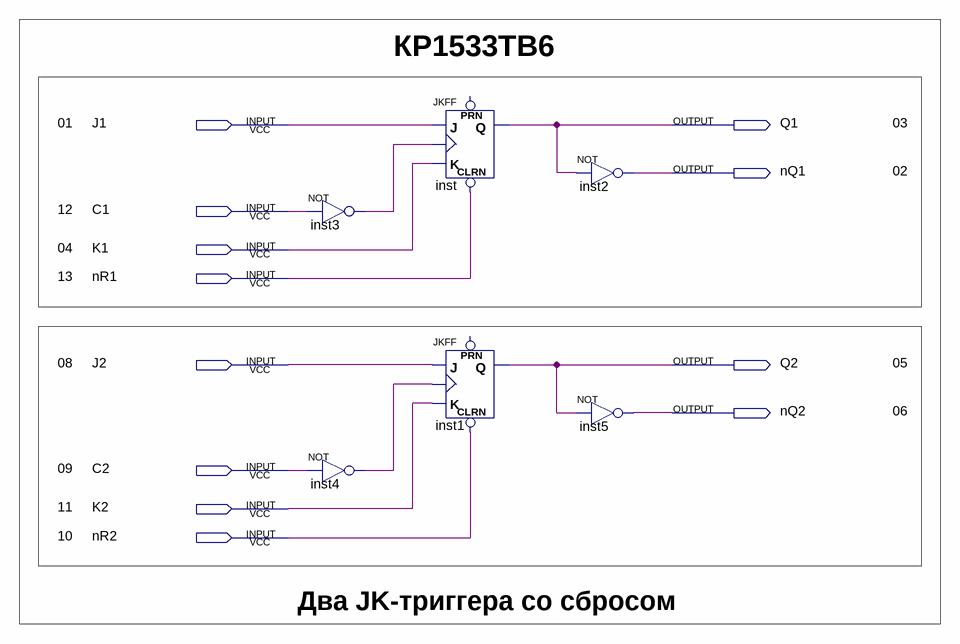
[diagram p0: schematic sheet]
// Quartus schematic KP1533TB6.bdf as structural Verilog: 6 symbols, 12 pins
module KP1533TB6 (
  input  J1,
  input  C1,
  input  K1,
  input  nR1,
  input  J2,
  input  C2,
  input  K2,
  input  nR2,
  output Q1,
  output nQ1,
  output Q2,
  output nQ2
);

  wire inst3_out, inst4_out;

  not inst3 (inst3_out, C1);
  not inst4 (inst4_out, C2);
  JKFF inst (.CLRN(nR1), .K(K1), .J(J1), .CLK(inst3_out), .Q(Q1));  // open: PRN
  JKFF inst1 (.CLRN(nR2), .K(K2), .J(J2), .CLK(inst4_out), .Q(Q2));  // open: PRN
  not inst2 (nQ1, Q1);
  not inst5 (nQ2, Q2);

  // Notes on the sheet:
  //   КР1533ТВ6
  //   01
  //   03
  //   02
  //   12
  //   04
  //   13
  //   08
  //   05
  //   06
  //   09
  //   11
  //   10
  //   Два JK-триггера со сбросом
endmodule
